# EAGLE design Beefy_3 (EAGLE 7.4.0)
DESIGNER: Brent Wilkins; VERSION: v10
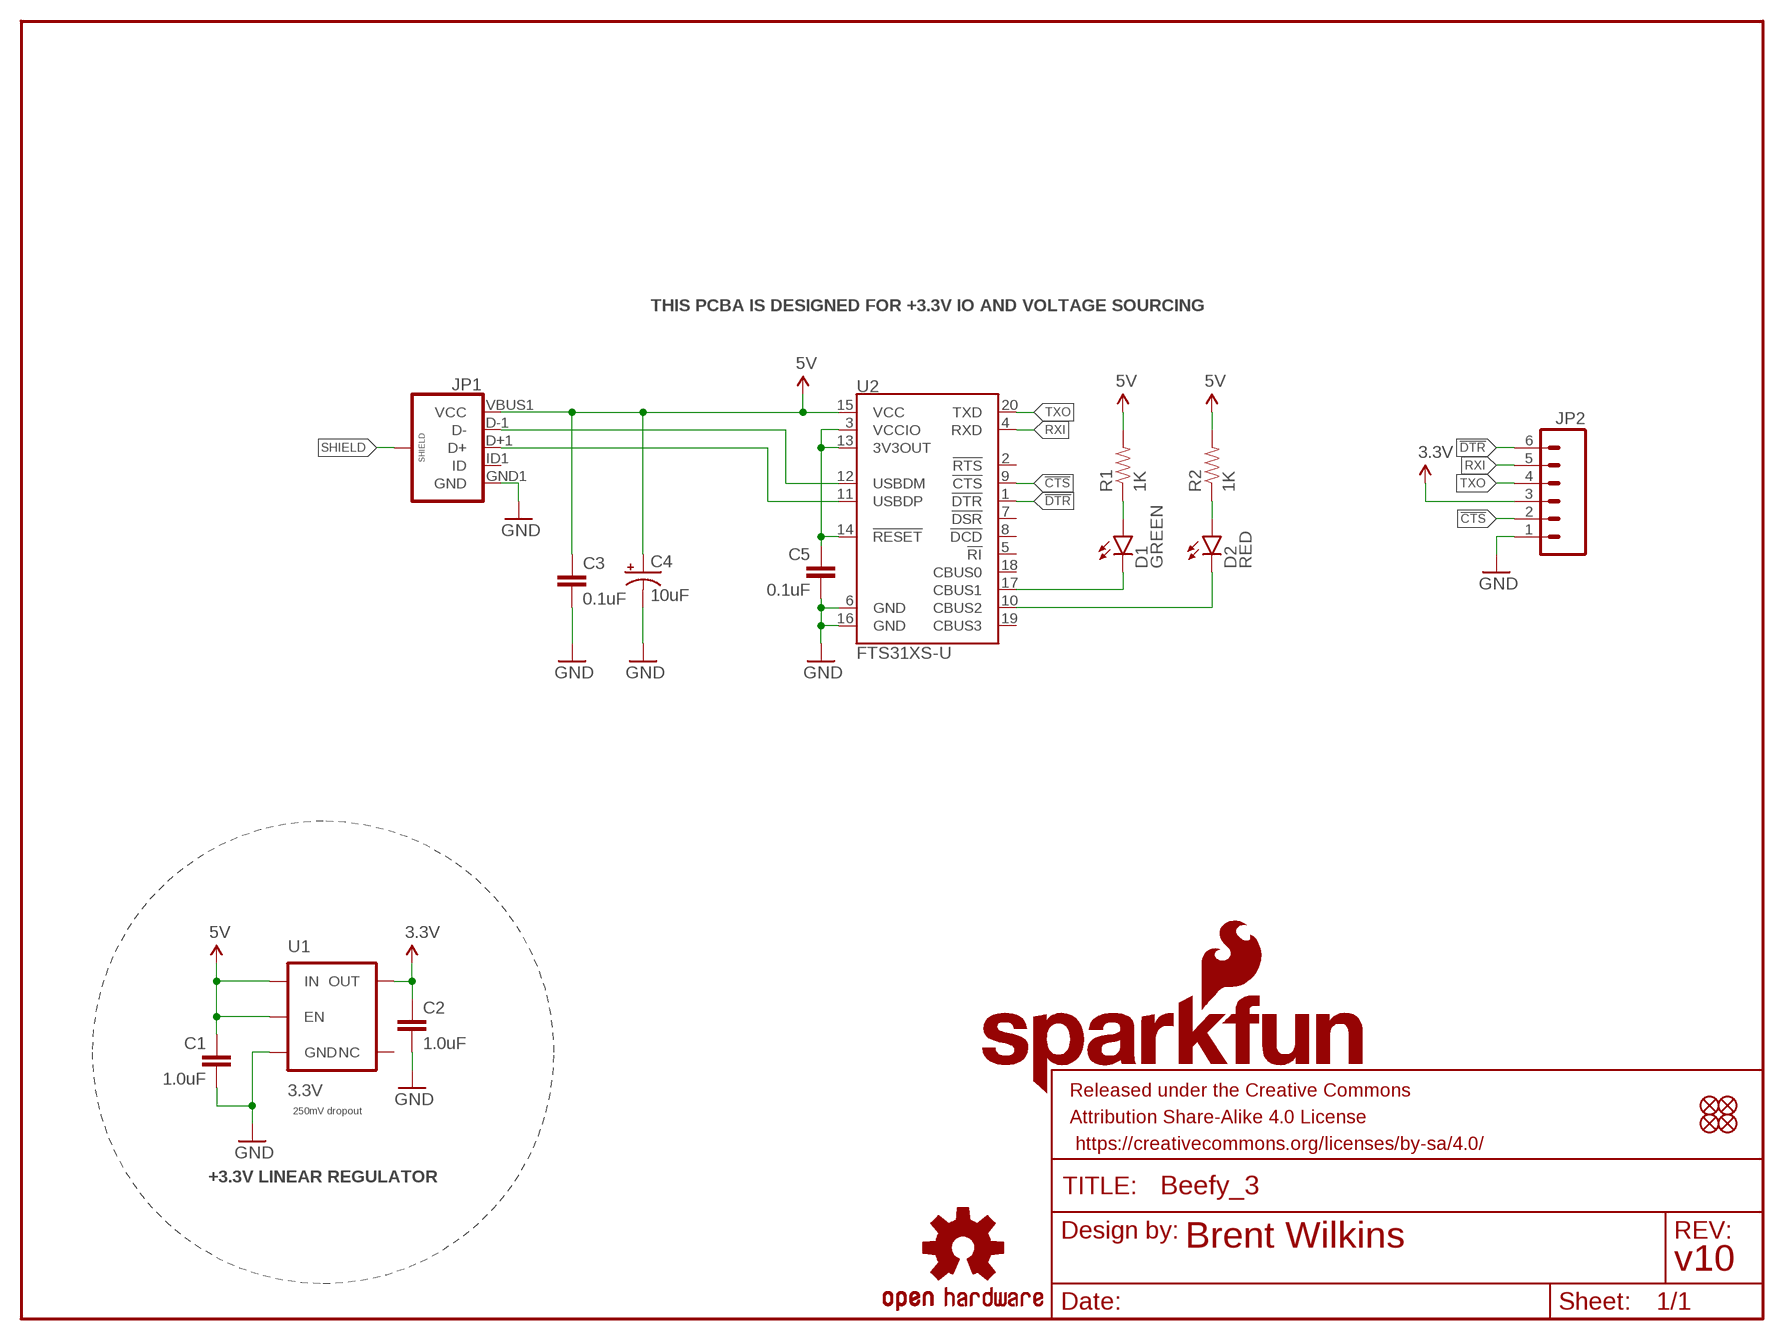
[diagram p0: schematic, sheet 1]

## Parts
C1  1.0uF  1.0UF-16V-10%(0603)  [0603-CAP]
C2  1.0uF  1.0UF-16V-10%(0603)  [0603-CAP]
C3  0.1uF  0.1UF-25V(+80/-20%)(0603)  [0603-CAP]
C4  10uF  10UF-16V-10%(TANT)  [EIA3216]
C5  0.1uF  0.1UF-25V(+80/-20%)(0603)  [0603-CAP]
D1  GREEN  LED-GREEN0603  [LED-0603]
D2  RED  LED-RED0603  [LED-0603]
FRAME1  FRAME-LETTER  [CREATIVE_COMMONS]
JP1  USB_MICROB_PLUGCONN-11752  [USB-B-MICRO-SMD_V03]
JP2  M06SMD-FEMALE-V2  [1X06-SMD-FEMALE-V2]
JP3  FIDUCIAL1X2  [FIDUCIAL-1X2]
JP4  FIDUCIAL1X2  [FIDUCIAL-1X2]
JP5  FIDUCIAL1X2  [FIDUCIAL-1X2]
JP6  FIDUCIAL1X2  [FIDUCIAL-1X2]
LOGO1  OSHW-LOGOS  [OSHW-LOGO-S]
LOGO2  SFE_LOGO_NAME.1_INCH  [SFE_LOGO_NAME_.1]
LOGO3  SFE_LOGO_FLAME.1_INCH  [SFE_LOGO_FLAME_.1]
R1  1K  1KOHM-1/10W-1%(0603)  [0603-RES]
R2  1K  1KOHM-1/10W-1%(0603)  [0603-RES]
U1  3.3V  V_REG_AP2112K-3.3V  [SOT23-5]
U2  FTS31XS-U  FT231XS  [SSOP20_L]

## Nets
3V3 [power]: C2.1 JP2.3 U1.5(OUT) ; supply symbol labelled 3.3V
3V3LC: C5.1 U2.3(VCCIO) U2.13(3V3OUT) U2.14(!RESET)
5V: C1.1 C3.1 C4.A(+) JP1.VBUS1(VCC) R1.2 R2.2 U1.1(IN) U1.3(EN) U2.15(VCC)
!CTS: JP2.2 U2.9(!CTS)
!DTR: JP2.6 U2.1(!DTR)
GND [power]: C1.2 C2.2 C3.2 C4.C(-) C5.2 JP1.GND1(GND) JP2.1 U1.2(GND) U2.6(GND) U2.16(GND)
N$1: D2.A R2.1
N$2: D1.A R1.1
RXI: JP2.5 U2.4(RXD)
RXLED: D1.C U2.17(CBUS1)
SHIELD: JP1.SHIELD1(SHIELD) JP1.SHIELD2(SHIELD) JP1.SHIELD3(SHIELD)
TXLED: D2.C U2.10(CBUS2)
TXO: JP2.4 U2.20(TXD)
USB_D+: JP1.D+1(D+) U2.11(USBDP)
USB_D-: JP1.D-1(D-) U2.12(USBDM)
Unconnected: JP1.ID1(ID) U1.4(NC) U2.2(!RTS) U2.5(!RI) U2.7(!DSR) U2.8(!DCD) U2.18(CBUS0) U2.19(CBUS3)

## Notes on the sheet
- THIS PCBA IS DESIGNED FOR +3.3V IO AND VOLTAGE SOURCING
- 250mV dropout
- +3.3V LINEAR REGULATOR

## Library data of the parts
C1 C2 = SparkFun-Capacitors:1.0UF-16V-10%(0603): CAP-00868; PROD_ID: CAP-00868
C3 C5 = SparkFun-Capacitors:0.1UF-25V(+80/-20%)(0603): CAP-00810 Ceramic Standard decoupling cap; PROD_ID: CAP-00810
C4 = SparkFun-Capacitors:10UF-16V-10%(TANT): CAP-00811 1206/EIA-3216 Tantalum capacitor; PROD_ID: CAP-00811
D1 = SparkFun-LED:LED-GREEN: Various green LEDs Green LEDs used in SFE Production 0603- DIO-00821 LARGE- DIO-00862 LILYPAD- DIO-09910; PROD_ID: DIO-00821
D2 = SparkFun-LED:LED-RED: Assorted Red LEDs LilyPad 1206- DIO-09912 1206- DIO-00809 0603- DIO-00819 "SMART" means more efficient and expensive; PROD_ID: DIO-00819
FRAME1 = SparkFun-Aesthetics:FRAME-LETTER: Schematic Frame Standard 8.5x11 US Letter frame
JP1 = SparkFun-Connectors:USB_MICROB_PLUG: USB Micro-B connectors Some male, some female. Watch your step!; PROD_ID: CONN-11752
JP2 = SparkFun-Connectors:M06: Header 6 Standard 6-pin 0.1" header. Use with straight break away headers (SKU : PRT-00116), right angle break away headers (PRT-00553), swiss pins (PRT-00743), machine pins (PRT-00117), and female headers (PRT-00115). Molex polarized connector foot print use with SKU : PRT-08094 with associated crimp pins and housings. NOTES ON THE VARIANTS LOCK and LOCK_LONGPADS... This footprint was designed to help hold the alignment of a through-hole component (i.e. 6-pin header) while soldering it into place. You may notice that each hole has been shifted either up or down by 0.005 of an inch from it's more standard position (which is a perfectly straight line). This slight alteration caused the pins (the squares in the middle) to touch the edges of the holes. Because they are alternating, it causes a "brace" to hold the component in place. 0.005 has proven to be the perfect amount of "off-center" position when using our standard breakaway headers. Although looks a little odd when you look at the bare footprint, once you have a header in there, the alteration is very hard to notice. Also,if you push a header all the way into place, it is covered up entirely on the bottom side. This idea of altering the position of holes to aid alignment will be further integrated into the Sparkfun Library for other footprints. It can help hold any component with 3 or more connection pins.; PROD_ID: CONN-09668
JP3-JP6 = SparkFun:FIDUCIAL: Fiducial Alignment Points Various fiducial points for machine vision alignment.
LOGO1 = SparkFun-Aesthetics:OSHW-LOGO: Open Source Hardware Logo This logo indicates the piece of hardware it is found on incorporates a OSHW license and/or adheres to the definition of open source hardware found here: http://freedomdefined.org/OSHW
LOGO2 = SparkFun-Aesthetics:SFE_LOGO_NAME: SFE Logo, name only This is the SparkFun name logo. The logo on the schematic will always be the same size; the package variant is the height of the flame part of the logo (or the height the flame would be, if it were drawn). Default layer for the logo on the board is tSilk.
LOGO3 = SparkFun-Aesthetics:SFE_LOGO_FLAME: SFE Logo, flame only This is the SparkFun flame logo. The logo on the schematic will always be the same size; the package variant is the height of the flame. Default layer for the logo on the board is tSilk.
R1 R2 = SparkFun-Resistors:1KOHM-1/10W-1%(0603): RES-07856; PROD_ID: RES-07856
U1 = SparkFun-PowerIC:V_REG_AP2112: AP2112 - 600mA CMOS LDO Regulator w/ Enable The AP2112 is CMOS process low dropout linear regulator with enable function, the regulator delivers a guaranteed 600mA (min.) continuous load current. Features Output Voltage Accuracy: ±1.5% Output Current: 600mA (Min.) Foldback Short Current Protection: 50mA Enable Function to Turn ON/OFF VOUT Low Dropout Voltage (3.3V): 250mV (Typ.) @IOUT=600mA Excellent Load Regulation: 0.2%/A (Typ.) Excellent Line Regulation: 0.02%/V (Typ.) Low Quiescent Current: 55μA (Typ.) Low Standby Current: 0.01μA (Typ.) Low Output Noise: 50μVRMS PSRR: 100Hz -65dB, 1kHz -65dB OTSD Protection Stable with 1.0μF Flexible Cap: Ceramic, Tantalum and Aluminum Electrolytic Operation Temperature Range: -40°C to 85°C ESD: MM 400V, HBM 4000V; PROD_ID: VREG-12457
U2 = SparkFun-DigitalIC:FT231X: FTDI FT231X Full Speed USB to Full-handshake UART This USB2.0 Full Speed IC offers a compact bridge to full handshake UART interfaces. The device is a UART, capable of operating up to 3MBaud, with low power consumption (8mA). The FT231X includes the complete FT-X series feature set and enables USB to be added into a system design quickly and easily over a UART interface.; PROD_ID: IC-11524

## Net classes
1 power: width 0.254 mm

## Board
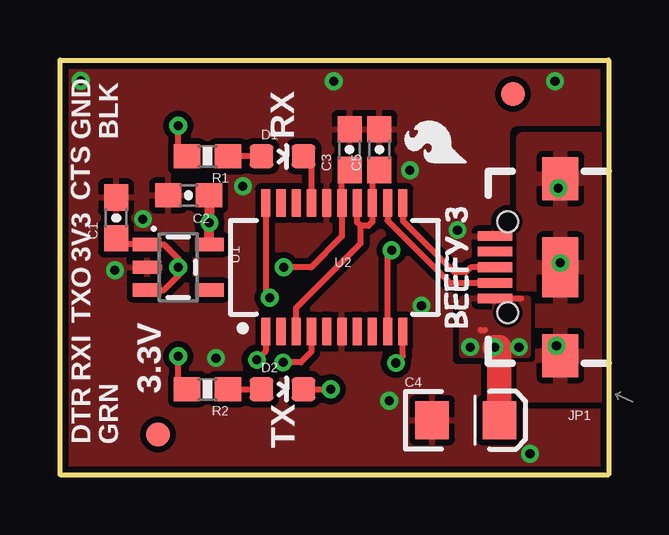
[diagram p1: board, top side]
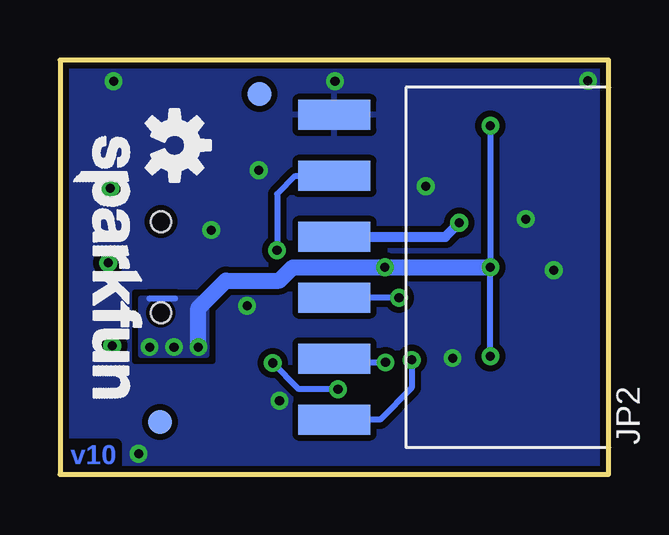
[diagram p2: board, bottom side, seen from below]

Size 22.86 x 17.27 mm. Coordinates in mm from the lower left corner, seen from the top.
Outline: 22.86,17.27 22.86,0 0,0 0,17.27 22.86,17.27
Copper layers (1*16): Top 0.035mm / dielectric 1.5mm / Bottom 0.035mm
Design rules "SparkFun-2-layer-TIGHT": minimum track width 7mil, minimum drill 15mil, track to track 7mil, track to pad 7mil, pad to pad 7mil, via to via 7mil, smd to smd 7mil, copper to edge 7mil, drill to drill 7mil, minimum pad ring 7mil, minimum via ring 7mil, stop-mask expansion 4mil, vias tented up to drill 20mil, thermal gap 10mil

### Footprints (pad centres in the part's own frame; a part is rotated, then mirrored left to right if it is on the bottom)
0603-CAP = smd 1.1 x 1: 1 -0.85,0; 2 0.85,0
EIA3216 = smd 1.4 x 1.6: A 1.4,0; C -1.4,0
LED-0603 = smd 1 x 1: A 0,-0.877; C 0,0.877
USB-B-MICRO-SMD_V03 = smd 1.45 x 0.4: D+1 2.725,0; D-1 2.725,0.65; GND1 2.725,-1.3; ID1 2.725,-0.65; VBUS1 2.725,1.3 | smd 1.5 x 1.8: SHIELD1 0,3.685; SHIELD2 0,-3.685 | smd 1.5 x 2.5: SHIELD3 0,0 | hole 0.85: 2.2,1.9; 2.2,-1.9
1X06-SMD-FEMALE-V2 = smd 1.25 x 3: 1 6.35,3.425; 2 3.81,3.425; 3 1.27,3.425; 4 -1.27,3.425; 5 -3.81,3.425; 6 -6.35,3.425
FIDUCIAL-1X2 = smd 1 x 1: 1 0,0
0603-RES = smd 1.1 x 1: 1 -0.85,0; 2 0.85,0
SOT23-5 = smd 0.55 x 1.2: 1 -0.95,-1.3; 2 0,-1.3; 3 0.95,-1.3; 4 0.95,1.3; 5 -0.95,1.3
SSOP20_L = smd 0.381 x 1.143: 1 -2.857,-2.68; 2 -2.223,-2.68; 3 -1.587,-2.68; 4 -0.953,-2.68; 5 -0.318,-2.68; 6 0.318,-2.68; 7 0.953,-2.68; 8 1.587,-2.68; 9 2.223,-2.68; 10 2.857,-2.68; 11 2.857,2.68; 12 2.223,2.68; 13 1.587,2.68; 14 0.953,2.68; 15 0.318,2.68; 16 -0.318,2.68; 17 -0.953,2.68; 18 -1.587,2.68; 19 -2.223,2.68; 20 -2.857,2.68

### Placement (x,y rotation side)
C1  2.34,10.69 90 top
C2  5.36,11.63 180 top
C3  12.06,13.54 90 top
C4  16.91,2.26 0 top
C5  13.31,13.54 90 top
D1  9.27,13.26 270 top
D2  9.27,3.56 270 top
FRAME1  -19.05,-13.97 0 top  (outside the outline)
JP1  20.85,8.64 180 top
JP2  8,8.64 90 bottom
JP3  4.09,1.68 0 top
JP4  18.69,2.18 0 bottom
JP5  18.87,15.85 0 top
JP6  14.55,15.85 0 bottom
LOGO1  18.08,13.72 270 bottom
LOGO2  22.78,14.58 270 bottom
LOGO3  17.27,12.7 90 top
R1  6.15,13.26 180 top
R2  6.15,3.56 180 top
U1  4.93,8.64 270 top
U2  11.43,8.64 0 top

### Tracks (layer width: path | path; a pad name or v marks a point on that pad's centre or on a via)
3V3  (via drill 0.38)
  Top 0.406: U1.5 v6.22,10.49 6.22,11.62 C2.1
  Bottom 0.406: JP2.3 6.81,9.91 v6.22,10.49
3V3LC
  Top 0.254: 12.52,10.36 12.85,10.36 13.02,10.53 U2.13 | 12.52,10.36 12.38,10.5 U2.14 | U2.3 9.84,6.95 12.52,9.63 12.52,10.36 | 13.03,11.28 U2.13 | U2.13 13.03,12.41 C5.1
5V  (via drill 0.38)
  Top 0.254: 17.53,6.02 17.7,6.02 | JP1.VBUS1 19.2,7.34 | C3.1 11.73,12.36 11.73,11.3 U2.15 11.75,9.92 10.46,8.64 v9.32,8.64 | C1.1 2.59,9.59 U1.1 4.33,9.59 4.93,8.99 v4.93,8.64 4.93,8.28 4.33,7.69 U1.3 | R1.2 4.93,13.26 v4.93,14.53 | R2.2 4.93,3.56 v4.93,4.93
  Top 1.016: 18.31,5.31 v18.11,5.31 | 18.31,5.31 | 18.31,5.31 C4.A
  Bottom 0.254: 19.13,7.34 18.06,7.34 | v4.93,14.53 v4.93,8.64 | v4.93,4.93 v4.93,8.64 | v4.93,8.64
  Bottom 0.66: v17.09,5.31 17.09,6.93 15.95,8.08 13.72,8.08 13.16,8.64 v9.32,8.64 v4.93,8.64
  other vias: 19.13,5.31
  pour Top: 16.76,7.34 19.48,7.34 19.48,4.98 16.76,4.98
  pour Bottom: 19.48,7.34 16.76,7.34 16.76,4.98 19.48,4.98
!CTS  (via drill 0.38)
  Top 0.254: U2.9 13.65,9.18 v13.82,9.35
  Bottom 0.254: JP2.2 13.06,12.45 13.82,11.68 v13.82,9.35
!DTR  (via drill 0.38)
  Top 0.254: U2.1 8.57,5.14 v8.2,4.78
  Bottom 0.254: v8.2,4.78 8.2,3.61 9.53,2.29 JP2.6
GND  (via drill 0.38)
  other vias: 14.58,12.67 2.29,8.51 3.45,10.64 20.62,16.38 19.58,0.86 0.86,16.41 11.4,16.38 13.72,3.07 7.62,12.01 15.06,7.04 16.56,10.19 6.5,4.85
  pour Bottom (isolate 0.254, rank 6): 0,0 0,17.27 22.86,17.27 22.86,0
  pour Top (isolate 0.254, rank 6): 0,0 0,17.27 22.86,17.27 22.86,0
N$1
  Top 0.254: R2.1 D2.A
N$2
  Top 0.254: D1.A R1.1
RXI  (via drill 0.38)
  Top 0.254: U2.4 10.48,5.12 10.03,4.67 v9.3,4.67
  Bottom 0.254: JP2.5 11.27,4.67 v9.3,4.67
RXLED
  Top 0.254: D1.C 10.48,12.93 U2.17
SHIELD  (via drill 0.38)
  other vias: 20.77,11.93 20.69,5.36 20.85,8.82
  pour Top (rank 2): 22.86,13.97 19.3,13.97 19.3,3.3 22.86,3.3
TXLED  (via drill 0.38)
  Top 0.254: D2.C v11.28,3.56 | v13.99,4.65 14.29,4.94 U2.10
  Bottom 0.254: v11.28,3.56 12.9,3.56 v13.99,4.65
TXO  (via drill 0.38)
  Top 0.254: U2.20 8.57,7.53 v8.74,7.37
  Bottom 0.254: v8.74,7.37 JP2.4
USB_D+
  Top 0.254: U2.11 14.29,10.57 16.42,8.43 16.92,8.43 17.12,8.64 JP1.D+1
USB_D-
  Top 0.254: JP1.D-1 16.25,7.99 13.65,10.58 U2.12

### Text on the board
tPlace: RX | GND | BLK | CTS | 3V3 | TXO | RXI | 3.3V | TX | DTR | GRN
tValues: Close